# EAGLE design Gyro MPU9250 (EAGLE 8.7.0)
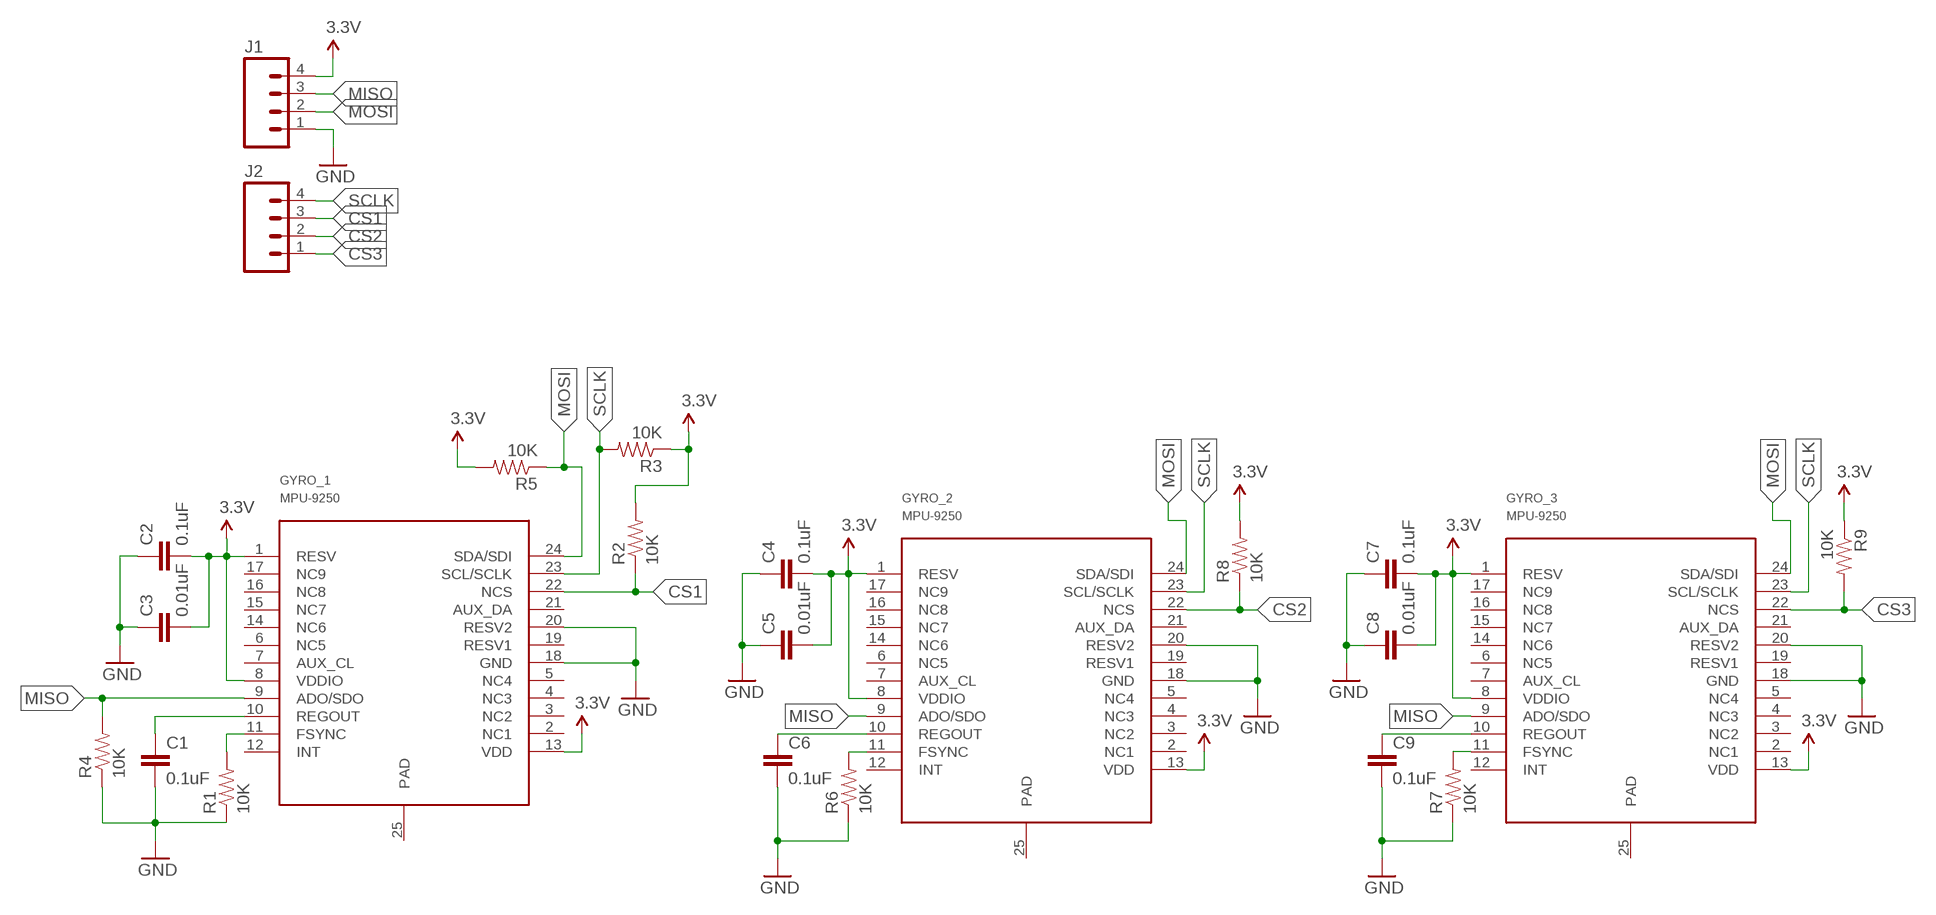
[diagram p0: schematic, sheet 1]

## Parts
C1  0.1uF  CAP0603-CAP  [0603-CAP]
C2  0.1uF  CAP0603-CAP  [0603-CAP]
C3  0.01uF  CAP0603-CAP  [0603-CAP]
C4  0.1uF  CAP0603-CAP  [0603-CAP]
C5  0.01uF  CAP0603-CAP  [0603-CAP]
C6  0.1uF  CAP0603-CAP  [0603-CAP]
C7  0.1uF  CAP0603-CAP  [0603-CAP]
C8  0.01uF  CAP0603-CAP  [0603-CAP]
C9  0.1uF  CAP0603-CAP  [0603-CAP]
GYRO_1  MPU-9250  [LEAD-QFN24]
GYRO_2  MPU-9250  [LEAD-QFN24]
GYRO_3  MPU-9250  [LEAD-QFN24]
J1  M04PTH  [1X04]
J2  M04PTH  [1X04]
R1  10K  RESISTOR0603-RES  [0603-RES]
R2  10K  RESISTOR0603-RES  [0603-RES]
R3  10K  RESISTOR0603-RES  [0603-RES]
R4  10K  RESISTOR0603-RES  [0603-RES]
R5  10K  RESISTOR0603-RES  [0603-RES]
R6  10K  RESISTOR0603-RES  [0603-RES]
R7  10K  RESISTOR0603-RES  [0603-RES]
R8  10K  RESISTOR0603-RES  [0603-RES]
R9  10K  RESISTOR0603-RES  [0603-RES]

## Nets
3.3V: C2.2 C3.2 C4.2 C5.2 C7.2 C8.2 GYRO_1.1(RESV) GYRO_1.8(VDDIO) GYRO_1.13(VDD) GYRO_2.1(RESV) GYRO_2.8(VDDIO) GYRO_2.13(VDD) GYRO_3.1(RESV) GYRO_3.8(VDDIO) GYRO_3.13(VDD) J1.4 R2.2 R3.1 R5.2 R8.2 R9.1
CS1: GYRO_1.22(NCS) J2.3 R2.1
CS2: GYRO_2.22(NCS) J2.2 R8.1
CS3: GYRO_3.22(NCS) J2.1 R9.2
GND: C1.2 C2.1 C3.1 C4.1 C5.1 C6.2 C7.1 C8.1 C9.2 GYRO_1.18(GND) GYRO_1.20(RESV2) GYRO_2.18(GND) GYRO_2.20(RESV2) GYRO_3.18(GND) GYRO_3.20(RESV2) J1.1 R1.1 R4.1 R6.1 R7.1
MISO: GYRO_1.9(ADO/SDO) GYRO_2.9(ADO/SDO) GYRO_3.9(ADO/SDO) J1.3 R4.2
MOSI: GYRO_1.24(SDA/SDI) GYRO_2.24(SDA/SDI) GYRO_3.24(SDA/SDI) J1.2 R5.1
N$1: C1.1 GYRO_1.10(REGOUT)
N$2: GYRO_1.11(FSYNC) R1.2
N$4: GYRO_3.11(FSYNC) R7.2
N$6: C6.1 GYRO_2.10(REGOUT)
N$7: C9.1 GYRO_3.10(REGOUT)
N$8: GYRO_2.11(FSYNC) R6.2
SCLK: GYRO_1.23(SCL/SCLK) GYRO_2.23(SCL/SCLK) GYRO_3.23(SCL/SCLK) J2.4 R3.2
Unconnected: GYRO_1.2(NC1) GYRO_1.3(NC2) GYRO_1.4(NC3) GYRO_1.5(NC4) GYRO_1.6(NC5) GYRO_1.7(AUX_CL) GYRO_1.12(INT) GYRO_1.14(NC6) GYRO_1.15(NC7) GYRO_1.16(NC8) GYRO_1.17(NC9) GYRO_1.19(RESV1) GYRO_1.21(AUX_DA) GYRO_1.25(PAD) GYRO_2.2(NC1) GYRO_2.3(NC2) GYRO_2.4(NC3) GYRO_2.5(NC4) GYRO_2.6(NC5) GYRO_2.7(AUX_CL) GYRO_2.12(INT) GYRO_2.14(NC6) GYRO_2.15(NC7) GYRO_2.16(NC8) GYRO_2.17(NC9) GYRO_2.19(RESV1) GYRO_2.21(AUX_DA) GYRO_2.25(PAD) GYRO_3.2(NC1) GYRO_3.3(NC2) GYRO_3.4(NC3) GYRO_3.5(NC4) GYRO_3.6(NC5) GYRO_3.7(AUX_CL) GYRO_3.12(INT) GYRO_3.14(NC6) GYRO_3.15(NC7) GYRO_3.16(NC8) GYRO_3.17(NC9) GYRO_3.19(RESV1) GYRO_3.21(AUX_DA) GYRO_3.25(PAD)

## Library data of the parts
C1-C9 = SparkFun-Capacitors:CAP: Capacitor Standard 0603 ceramic capacitor, and 0.1" leaded capacitor.
GYRO_1-GYRO_3 = invensense:MPU-9250
J1 J2 = SparkFun-Connectors:M04: Header 4 Standard 4-pin 0.1" header. Use with straight break away headers (SKU : PRT-00116), right angle break away headers (PRT-00553), swiss pins (PRT-00743), machine pins (PRT-00117), and female headers (PRT-00115). Molex polarized connector foot print use with SKU : PRT-08231 with associated crimp pins and housings. 1MM SMD Version SKU: PRT-10208; PROD_ID: CONN-09696
R1-R9 = SparkFun-Resistors:RESISTOR: Resistor Basic schematic elements and footprints for 0603, 1206, and PTH resistors.

## Board
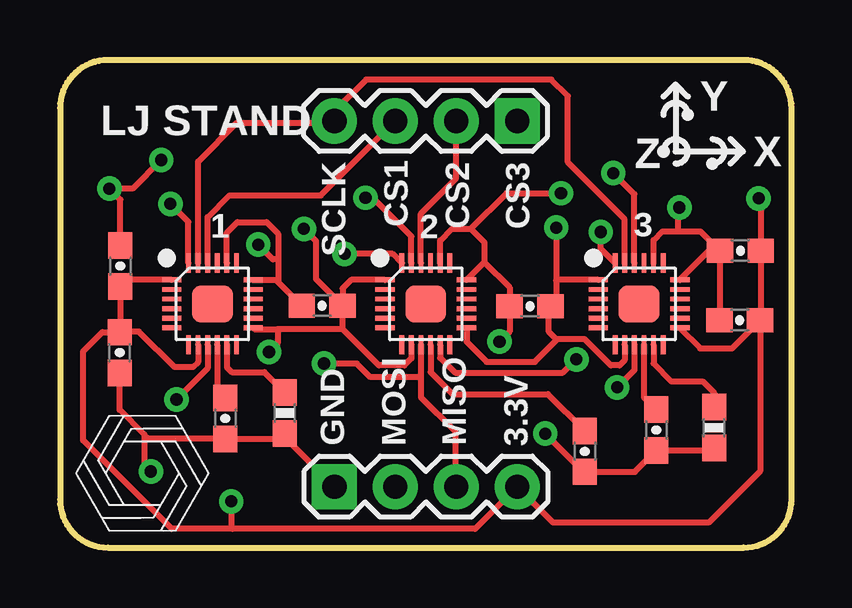
[diagram p1: board, top side]
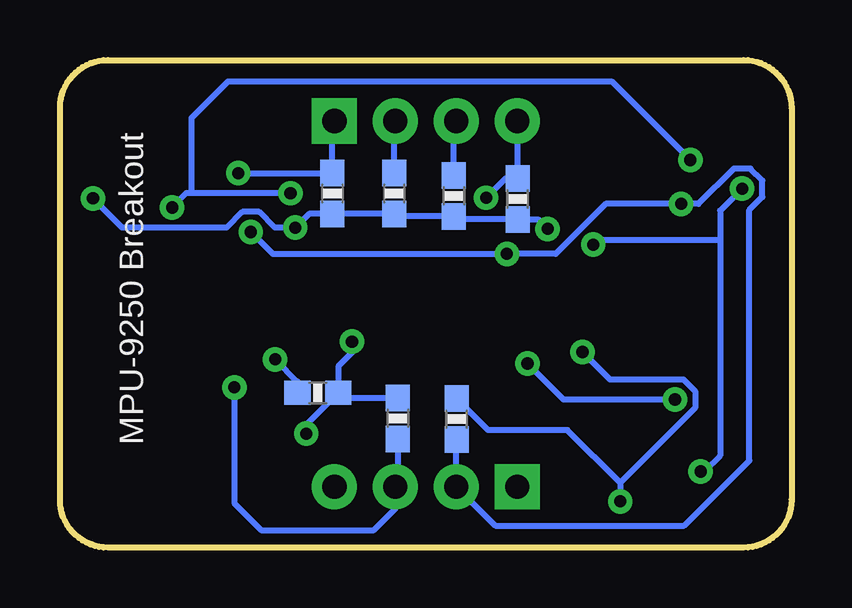
[diagram p2: board, bottom side, seen from below]

Size 30.48 x 20.32 mm. Coordinates in mm from the lower left corner, seen from the top.
Outline: 2,20.32 arc90 0,18.32 0,2 arc90 2,0 28.48,0 arc90 30.48,2 30.48,18.32 arc90 28.48,20.32 2,20.32
Copper layers (1*16): Top 0.035mm / dielectric 1.5mm / Bottom 0.035mm
Design rules "SparkFun": minimum track width 8mil, minimum drill 20mil, track to track 8mil, track to pad 8mil, pad to pad 8mil, via to via 8mil, smd to smd 8mil, copper to edge 10mil, drill to drill 8mil, minimum pad ring 12mil, minimum via ring 10mil, stop-mask expansion 4mil, vias tented up to drill 25mil, thermal gap 10mil

### Footprints (pad centres in the part's own frame; a part is rotated, then mirrored left to right if it is on the bottom)
0603-CAP = smd 1.1 x 1: 1 -0.85,0; 2 0.85,0
LEAD-QFN24 = smd 0.8 x 0.2: 1 -1.7,1; 2 -1.7,0.6; 3 -1.7,0.2; 4 -1.7,-0.2; 5 -1.7,-0.6; 6 -1.7,-1; 13 1.7,-1; 14 1.7,-0.6; 15 1.7,-0.2; 16 1.7,0.2; 17 1.7,0.6; 18 1.7,1 | smd 0.2 x 0.8: 7 -1,-1.7; 8 -0.6,-1.7; 9 -0.2,-1.7; 10 0.2,-1.7; 11 0.6,-1.7; 12 1,-1.7; 19 1,1.7; 20 0.6,1.7; 21 0.2,1.7; 22 -0.2,1.7; 23 -0.6,1.7; 24 -1,1.7 | smd 1.7 x 1.54: 25 0,0
1X04 = drill 1.016 pad 1.88 square: 1 0,0 | drill 1.016 pad 1.88: 2 2.54,0; 3 5.08,0; 4 7.62,0
0603-RES = smd 1.1 x 1: 1 -0.85,0; 2 0.85,0

### Placement (x,y rotation side)
C1  6.88,5.38 270 top
C2  19.58,10.06 0 top
C3  10.92,10.08 0 top
C4  28.35,12.37 0 top
C5  28.32,9.47 0 top
C6  21.87,4.01 270 top
C7  2.51,11.73 270 top
C8  2.49,8.13 90 top
C9  24.84,4.9 270 top
GYRO_1  6.35,10.16 0 top
GYRO_2  15.24,10.16 0 top
GYRO_3  24.13,10.16 0 top
J1  11.43,2.54 0 top
J2  19.05,17.78 180 top
R1  9.37,5.61 90 top
R2  14.07,14.66 270 bottom
R3  11.4,14.53 90 bottom
R4  16.41,5.38 270 bottom
R5  13.94,5.36 90 bottom
R6  19.74,6.45 180 bottom
R7  27.25,5 90 top
R8  16.56,14.76 270 bottom
R9  19.13,14.76 90 bottom

### Tracks (layer width: path | path; a pad name or v marks a point on that pad's centre or on a via)
3.3V  (via drill 0.51)
  Top 0.254: GYRO_1.1 2.79,11.16 C7.2 2.52,9 | 2.52,9 C8.2 1.76,8.98 0.96,8.18 0.96,4.47 4.65,0.79 7.19,0.79 | GYRO_1.8 5.75,7.73 5.54,7.52 4.78,7.52 3.29,9 2.52,9 | C5.2 29.2,9.5 C4.2 29.2,14.47 v29.11,14.55 | C5.2 28,8.31 26.67,8.31 25.83,9.15 GYRO_3.13 | 7.19,0.79 17.3,0.79 J1.4 20.55,1.04 27.03,1.04 29.17,3.19 C5.2 | GYRO_2.8 14.64,7.88 14.35,7.59 13.28,7.59 11.77,9.11 | 11.77,9.11 C3.2 | GYRO_2.1 12.12,11.16 11.77,10.81 C3.2 | v20.68,13.34 20.68,11.12 | 20.68,11.12 20.68,10.3 C2.2 20.37,10 20.37,8.99 20.68,8.69 | GYRO_3.8 23.53,7.81 23.32,7.59 22.95,7.59 21.86,8.69 20.68,8.69 | 11.77,9.11 9.07,9.11 | 9.07,9.11 8.1,9.11 GYRO_1.13 | 9.07,9.11 9.07,8.51 v8.71,8.15 | v7.14,1.93 7.14,0.84 7.19,0.79 | 20.68,11.12 20.71,11.16 GYRO_3.1 | GYRO_2.13 16.94,8.59 17.78,7.75 19.79,7.75 20.68,8.64 20.68,8.69 | C3.2 10.67,11.19 10.67,12.78 v10.16,13.28
  Bottom 0.254: v29.11,14.55 27.89,13.34 23.54,13.34 22.88,13.99 22.18,13.99 21.52,13.34 v20.68,13.34 20.1,13.91 R9.1 R8.2 16.46,13.81 R2.2 13.95,13.68 R3.1 10.55,13.68 v10.16,13.28 | v8.71,8.15 7.57,7.01 4.5,7.01 4.01,6.52 4.01,5.83 7.14,2.7 | 7.14,2.7 v7.14,1.93 | 7.14,2.7 9.34,4.9 12.64,4.9 R5.2
CS1
  Top 0.254: GYRO_1.22 6.15,13.77 7.06,14.68 10.87,14.68 J2.3
  Bottom 0.254: R2.1 14.07,17.68 J2.3
CS2
  Top 0.254: GYRO_2.22 15.04,13.92 16.51,15.39 J2.2
  Bottom 0.254: R8.1 16.56,17.73 J2.2
CS3  (via drill 0.51)
  Top 0.254: GYRO_3.22 23.93,14.73 v23.05,15.61
  Bottom 0.254: J2.1 19.13,17.7 R9.2 v23.05,15.61
GND  (via drill 0.51)
  Top 0.254: GYRO_3.20 24.73,12.82 25.09,13.18 25.73,13.18 | GYRO_3.18 27.04,12.37 C4.1 | 25.73,13.18 26.68,13.18 C4.1 | C4.1 27.5,9.5 C5.1 | R7.1 27.15,4.05 C9.2 23.95,3.16 C6.2 21.8,3.16 v20.22,4.75 | J1.1 9.37,4.6 R1.1 9.14,4.54 C1.2 3.69,4.54 3.52,4.71 | GYRO_1.20 6.95,13.12 7.39,13.56 8.61,13.56 9.09,13.08 9.09,12.01 | 9.09,12.01 9.09,11.06 | 9.09,11.06 C3.1 | GYRO_1.18 9,11.16 9.09,11.06 | C8.1 2.49,5.74 3.52,4.71 | GYRO_2.20 15.84,12.79 16.33,13.28 17.12,13.28 | 17.12,13.28 17.68,12.72 17.68,11.9 | 17.68,11.9 18.73,10.84 C2.1 18.73,9.01 v18.31,8.59 | 17.12,13.28 18.61,14.77 v20.88,14.77 | v25.81,14.17 25.73,14.1 25.73,13.18 | 3.52,4.71 3.52,3.44 v3.79,3.17 | C7.1 2.52,14.5 v2.06,14.96 3.02,14.96 v4.22,16.15 | 9.09,12.01 8.87,12.01 v8.26,12.63 | GYRO_2.18 17.68,11.9
  Bottom 0.254: R4.1 18.67,6.24 R6.1 | v20.88,14.77 24.99,14.77 | 24.99,14.77 25.21,14.77 v25.81,14.17 | R6.1 18.89,7.56 18.31,8.13 v18.31,8.59 | R6.1 20.22,5.12 v20.22,4.75 | v2.06,14.96 2.97,14.05 2.97,12.83 | 2.97,12.83 2.97,3.83 3.63,3.17 v3.79,3.17 | v8.26,12.63 8.06,12.83 2.97,12.83 | 24.99,14.77 24.99,17.91 23.47,19.43 7.49,19.43 v4.22,16.15
MISO  (via drill 0.51)
  Top 0.254: GYRO_3.9 23.93,7.39 v23.22,6.68 | GYRO_2.9 15.04,7.11 | J1.3 16.46,2.59 16.46,4.85 15.04,6.27 15.04,7.11 | GYRO_1.9 6.15,7.47 v4.85,6.17 | v11,7.67 12.37,7.67 12.93,7.11 15.04,7.11
  Bottom 0.254: R4.2 16.41,2.64 J1.3 16.51,1.63 17.4,0.74 22.1,0.74 23.22,1.85 v23.22,6.68 | v4.85,6.17 9.5,6.17 v11,7.67
MOSI  (via drill 0.51)
  Top 0.254: GYRO_1.24 5.35,13.57 v4.6,14.33 | GYRO_2.24 13.86,12.24 v11.86,12.24 | GYRO_3.24 22.53,12.46 v22.53,13.16
  Bottom 0.254: R5.1 13.97,4.48 J1.2 12.34,0.91 4.47,0.91 1.75,3.63 1.75,14.08 1.22,14.61 1.22,15.31 1.71,15.8 2.4,15.8 3.88,14.33 v4.6,14.33 7.75,14.33 9.83,12.24 v11.86,12.24 21.61,12.24 v22.53,13.16
N$1
  Top 0.254: GYRO_1.10 6.55,6.57 C1.1
N$2
  Top 0.254: GYRO_1.11 6.95,7.53 7.16,7.32 8.52,7.32 R1.2
N$4
  Top 0.254: GYRO_3.11 24.73,7.68 25.48,6.93 26.77,6.93 27.25,6.45 R7.2
N$6
  Top 0.254: C6.1 20.33,6.4 19,6.4 16.36,6.4 15.44,7.32 GYRO_2.10
N$7
  Top 0.254: GYRO_3.10 24.33,6.26 C9.1
N$8  (via drill 0.51)
  Top 0.254: GYRO_2.11 15.84,7.91 16.46,7.29 20.95,7.29 v21.51,7.85
  Bottom 0.254: v21.51,7.85 20.59,6.92 R6.2
SCLK  (via drill 0.51)
  Top 0.254: GYRO_1.23 5.75,16.09 7.37,17.7 11.35,17.7 J2.4 11.43,18.19 12.75,19.51 20.47,19.51 21.16,18.82 21.16,16.05 23.53,13.68 GYRO_3.23 | GYRO_2.23 14.64,12.97 13.03,14.58 v12.72,14.58
  Bottom 0.254: J2.4 11.4,17.75 R3.2 11.93,15.38 v12.72,14.58

### Text on the board
tPlace: Y | LJ STAND | SCLK | CS1 | CS2 | CS3 | Z | X | 1 | 2 | 3 | GND | MOSI | MISO | 3.3V
bPlace: MPU-9250 Breakout